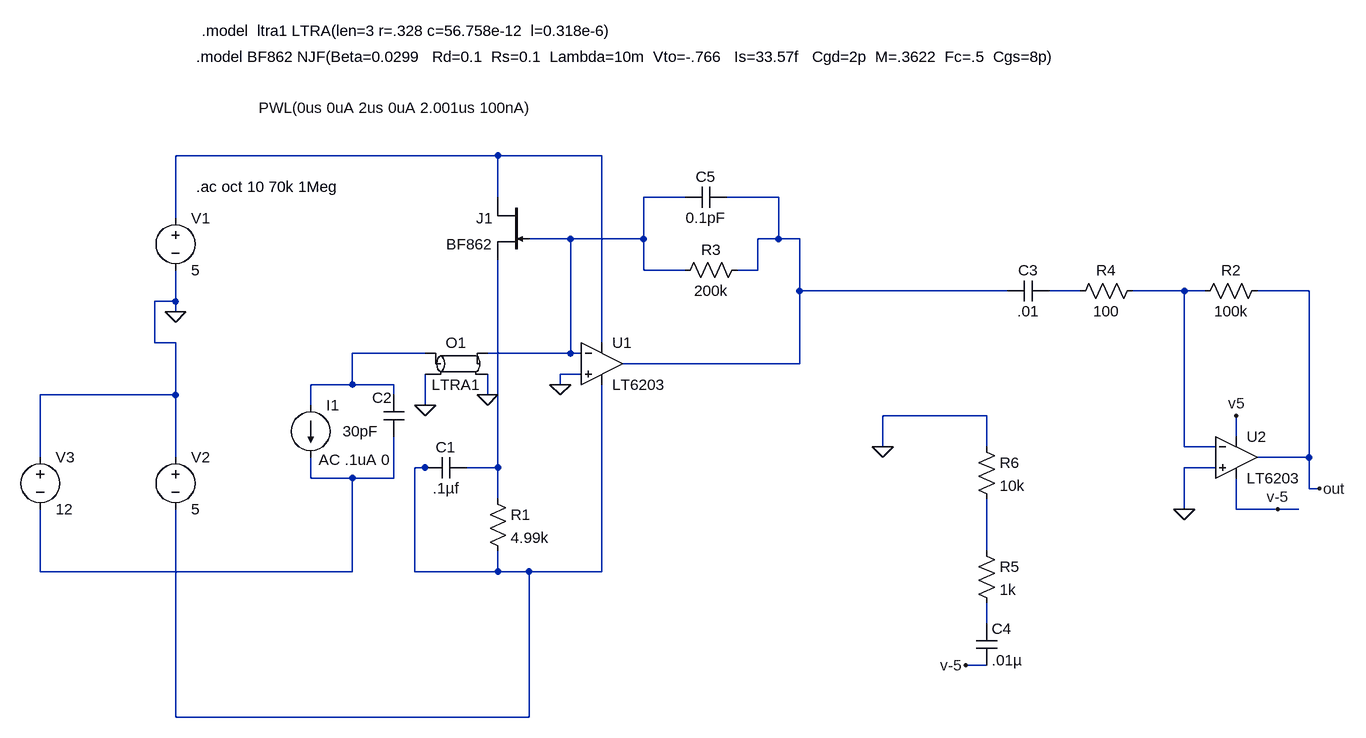
[diagram p0: schematic bootstrp6203 4_22_10wcable.asc]
bootstrp6203 4_22_10wcable.asc, the LTspice schematic file:
Version 4
SHEET 1 3232 872
WIRE -1552 -432 -2048 -432
WIRE -1392 -432 -1552 -432
WIRE -1552 -368 -1552 -432
WIRE -1264 -368 -1328 -368
WIRE -1120 -368 -1200 -368
WIRE -2048 -336 -2048 -432
WIRE -1440 -304 -1504 -304
WIRE -1328 -304 -1328 -368
WIRE -1328 -304 -1440 -304
WIRE -1120 -304 -1120 -368
WIRE -1120 -304 -1152 -304
WIRE -1088 -304 -1120 -304
WIRE -1328 -256 -1328 -304
WIRE -1264 -256 -1328 -256
WIRE -1152 -256 -1152 -304
WIRE -1152 -256 -1184 -256
WIRE -1088 -224 -1088 -304
WIRE -768 -224 -1088 -224
WIRE -656 -224 -704 -224
WIRE -496 -224 -576 -224
WIRE -464 -224 -496 -224
WIRE -304 -224 -384 -224
WIRE -2048 -208 -2048 -256
WIRE -2048 -208 -2080 -208
WIRE -2048 -192 -2048 -208
WIRE -2080 -144 -2080 -208
WIRE -2048 -144 -2080 -144
WIRE -1392 -144 -1392 -432
WIRE -1664 -128 -1776 -128
WIRE -1440 -128 -1440 -304
WIRE -1440 -128 -1568 -128
WIRE -1424 -128 -1440 -128
WIRE -1088 -112 -1088 -224
WIRE -1088 -112 -1360 -112
WIRE -1424 -96 -1456 -96
WIRE -1776 -80 -1776 -128
WIRE -1776 -80 -1840 -80
WIRE -1712 -80 -1776 -80
WIRE -1456 -80 -1456 -96
WIRE -2048 -64 -2048 -144
WIRE -2048 -64 -2256 -64
WIRE -1712 -64 -1712 -80
WIRE -1568 -64 -1568 -96
WIRE -1840 -48 -1840 -80
WIRE -1664 -48 -1664 -96
WIRE -800 -32 -960 -32
WIRE -416 0 -416 -32
WIRE -960 16 -960 -32
WIRE -800 16 -800 -32
WIRE -496 16 -496 -224
WIRE -448 16 -496 16
WIRE -2256 32 -2256 -64
WIRE -2048 32 -2048 -64
WIRE -304 32 -304 -224
WIRE -304 32 -384 32
WIRE -1664 48 -1680 48
WIRE -1648 48 -1664 48
WIRE -1552 48 -1552 -272
WIRE -1552 48 -1600 48
WIRE -448 48 -496 48
WIRE -1840 64 -1840 32
WIRE -1776 64 -1840 64
WIRE -1712 64 -1712 0
WIRE -1712 64 -1776 64
WIRE -304 80 -304 32
WIRE -288 80 -304 80
WIRE -1552 96 -1552 48
WIRE -496 112 -496 48
WIRE -416 112 -416 64
WIRE -352 112 -416 112
WIRE -320 112 -352 112
WIRE -800 176 -800 96
WIRE -2256 208 -2256 112
WIRE -1776 208 -1776 64
WIRE -1776 208 -2256 208
WIRE -1680 208 -1680 48
WIRE -1552 208 -1552 176
WIRE -1552 208 -1680 208
WIRE -1504 208 -1552 208
WIRE -1392 208 -1392 -80
WIRE -1392 208 -1504 208
WIRE -800 288 -800 256
WIRE -800 352 -832 352
WIRE -2048 432 -2048 112
WIRE -1504 432 -1504 208
WIRE -1504 432 -2048 432
FLAG -2048 -192 0
FLAG -1456 -80 0
FLAG -1568 -64 0
FLAG -1664 -48 0
FLAG -416 -32 v5
FLAG -288 80 out
FLAG -352 112 v-5
FLAG -832 352 v-5
FLAG -960 16 0
FLAG -496 112 0
SYMBOL voltage -2048 -352 R0
SYMATTR InstName V1
SYMATTR Value 5
SYMBOL current -1840 -48 R0
WINDOW 3 -80 -458 Left 0
WINDOW 123 12 84 Left 0
WINDOW 39 0 0 Left 0
SYMATTR Value PWL(0us 0uA 2us 0uA 2.001us 100nA)
SYMATTR Value2 AC .1uA 0
SYMATTR InstName I1
SYMBOL voltage -2048 16 R0
SYMATTR InstName V2
SYMATTR Value 5
SYMBOL cap -1728 -64 R0
WINDOW 0 -17 4 Left 0
WINDOW 3 -63 56 Left 0
SYMATTR InstName C2
SYMATTR Value 30pF
SYMBOL res -1168 -272 R90
WINDOW 0 0 56 VBottom 0
WINDOW 3 32 56 VTop 0
SYMATTR InstName R3
SYMATTR Value 200k
SYMBOL cap -1200 -384 R90
WINDOW 0 0 32 VBottom 0
WINDOW 3 32 32 VTop 0
SYMATTR InstName C5
SYMATTR Value 0.1pF
SYMBOL njf -1504 -368 M0
SYMATTR InstName J1
SYMATTR Value BF862
SYMBOL res -1568 80 R0
SYMATTR InstName R1
SYMATTR Value 4.99k
SYMBOL ltline -1616 -112 R0
SYMATTR InstName O1
SYMATTR Value LTRA1
SYMBOL cap -1600 32 R90
WINDOW 0 0 32 VBottom 0
WINDOW 3 32 32 VTop 0
SYMATTR InstName C1
SYMATTR Value .1µf
SYMBOL Opamps\\LT6203 -1392 -112 R0
SYMATTR InstName U1
SYMBOL voltage -2256 16 R0
WINDOW 123 0 0 Left 0
WINDOW 39 0 0 Left 0
SYMATTR InstName V3
SYMATTR Value 12
SYMBOL res -368 -240 R90
WINDOW 0 0 56 VBottom 0
WINDOW 3 32 56 VTop 0
SYMATTR InstName R2
SYMATTR Value 100k
SYMATTR SpiceLine tol=1
SYMBOL res -560 -240 R90
WINDOW 0 0 56 VBottom 0
WINDOW 3 32 56 VTop 0
SYMATTR InstName R4
SYMATTR Value 100
SYMATTR SpiceLine tol=1
SYMBOL Opamps\\LT6203 -416 32 R0
SYMATTR InstName U2
SYMBOL cap -704 -240 R90
WINDOW 0 0 32 VBottom 0
WINDOW 3 32 32 VTop 0
SYMATTR InstName C3
SYMATTR Value .01
SYMBOL res -816 160 R0
SYMATTR InstName R5
SYMATTR Value 1k
SYMBOL res -816 0 R0
SYMATTR InstName R6
SYMATTR Value 10k
SYMBOL cap -816 288 R0
SYMATTR InstName C4
SYMATTR Value .01µ
TEXT -2016 -584 Left 0 !.model BF862 NJF(Beta=0.0299   Rd=0.1  Rs=0.1  Lambda=10m  Vto=-.766   Is=33.57f   Cgd=2p  M=.3622  Fc=.5  Cgs=8p)
TEXT -2016 -384 Left 0 !.ac oct 10 70k 1Meg
TEXT -2008 -624 Left 0 !.model  ltra1 LTRA(len=3 r=.328 c=56.758e-12  l=0.318e-6)

The netlist it stands for:
* bootstrp6203 4_22_10wcable.asc
V1 N001 0 5
I1 N006 N009 PWL(0us 0uA 2us 0uA 2.001us 100nA) AC .1uA 0
V2 0 N007 5
C2 N006 N009 30pF
R3 N003 N002 200k
C5 N003 N002 0.1pF
J1 N001 N002 N008 BF862
R1 N008 N007 4.99k
O1 N006 0 N002 0 LTRA1
C1 N008 N007 .1µf
* U1: LT6203 (symbol Opamps\LT6203 not available, pins judged from their places): In+=0 In-=N002 V+=N001 V-=N007 OUT=N003
V3 0 N009 12
R2 out N005 100k tol=1
R4 N005 N004 100 tol=1
* U2: LT6203 (symbol Opamps\LT6203 not available, pins judged from their places): In+=0 In-=N005 V+=v5 V-=v-5 OUT=out
C3 N004 N003 .01
R5 N010 N011 1k
R6 0 N010 10k
C4 N011 v-5 .01µ
.model NJF NJF
.model PJF PJF
.lib standard.jft
.model BF862 NJF(Beta=0.0299   Rd=0.1  Rs=0.1  Lambda=10m  Vto=-.766   Is=33.57f   Cgd=2p  M=.3622  Fc=.5  Cgs=8p)
.ac oct 10 70k 1Meg
.model  ltra1 LTRA(len=3 r=.328 c=56.758e-12  l=0.318e-6)
.backanno
.end